# Altium schematic sheet MicroController.SchDoc
size 431 x 279 mm; SheetNumber: 2; SheetTotal: 10
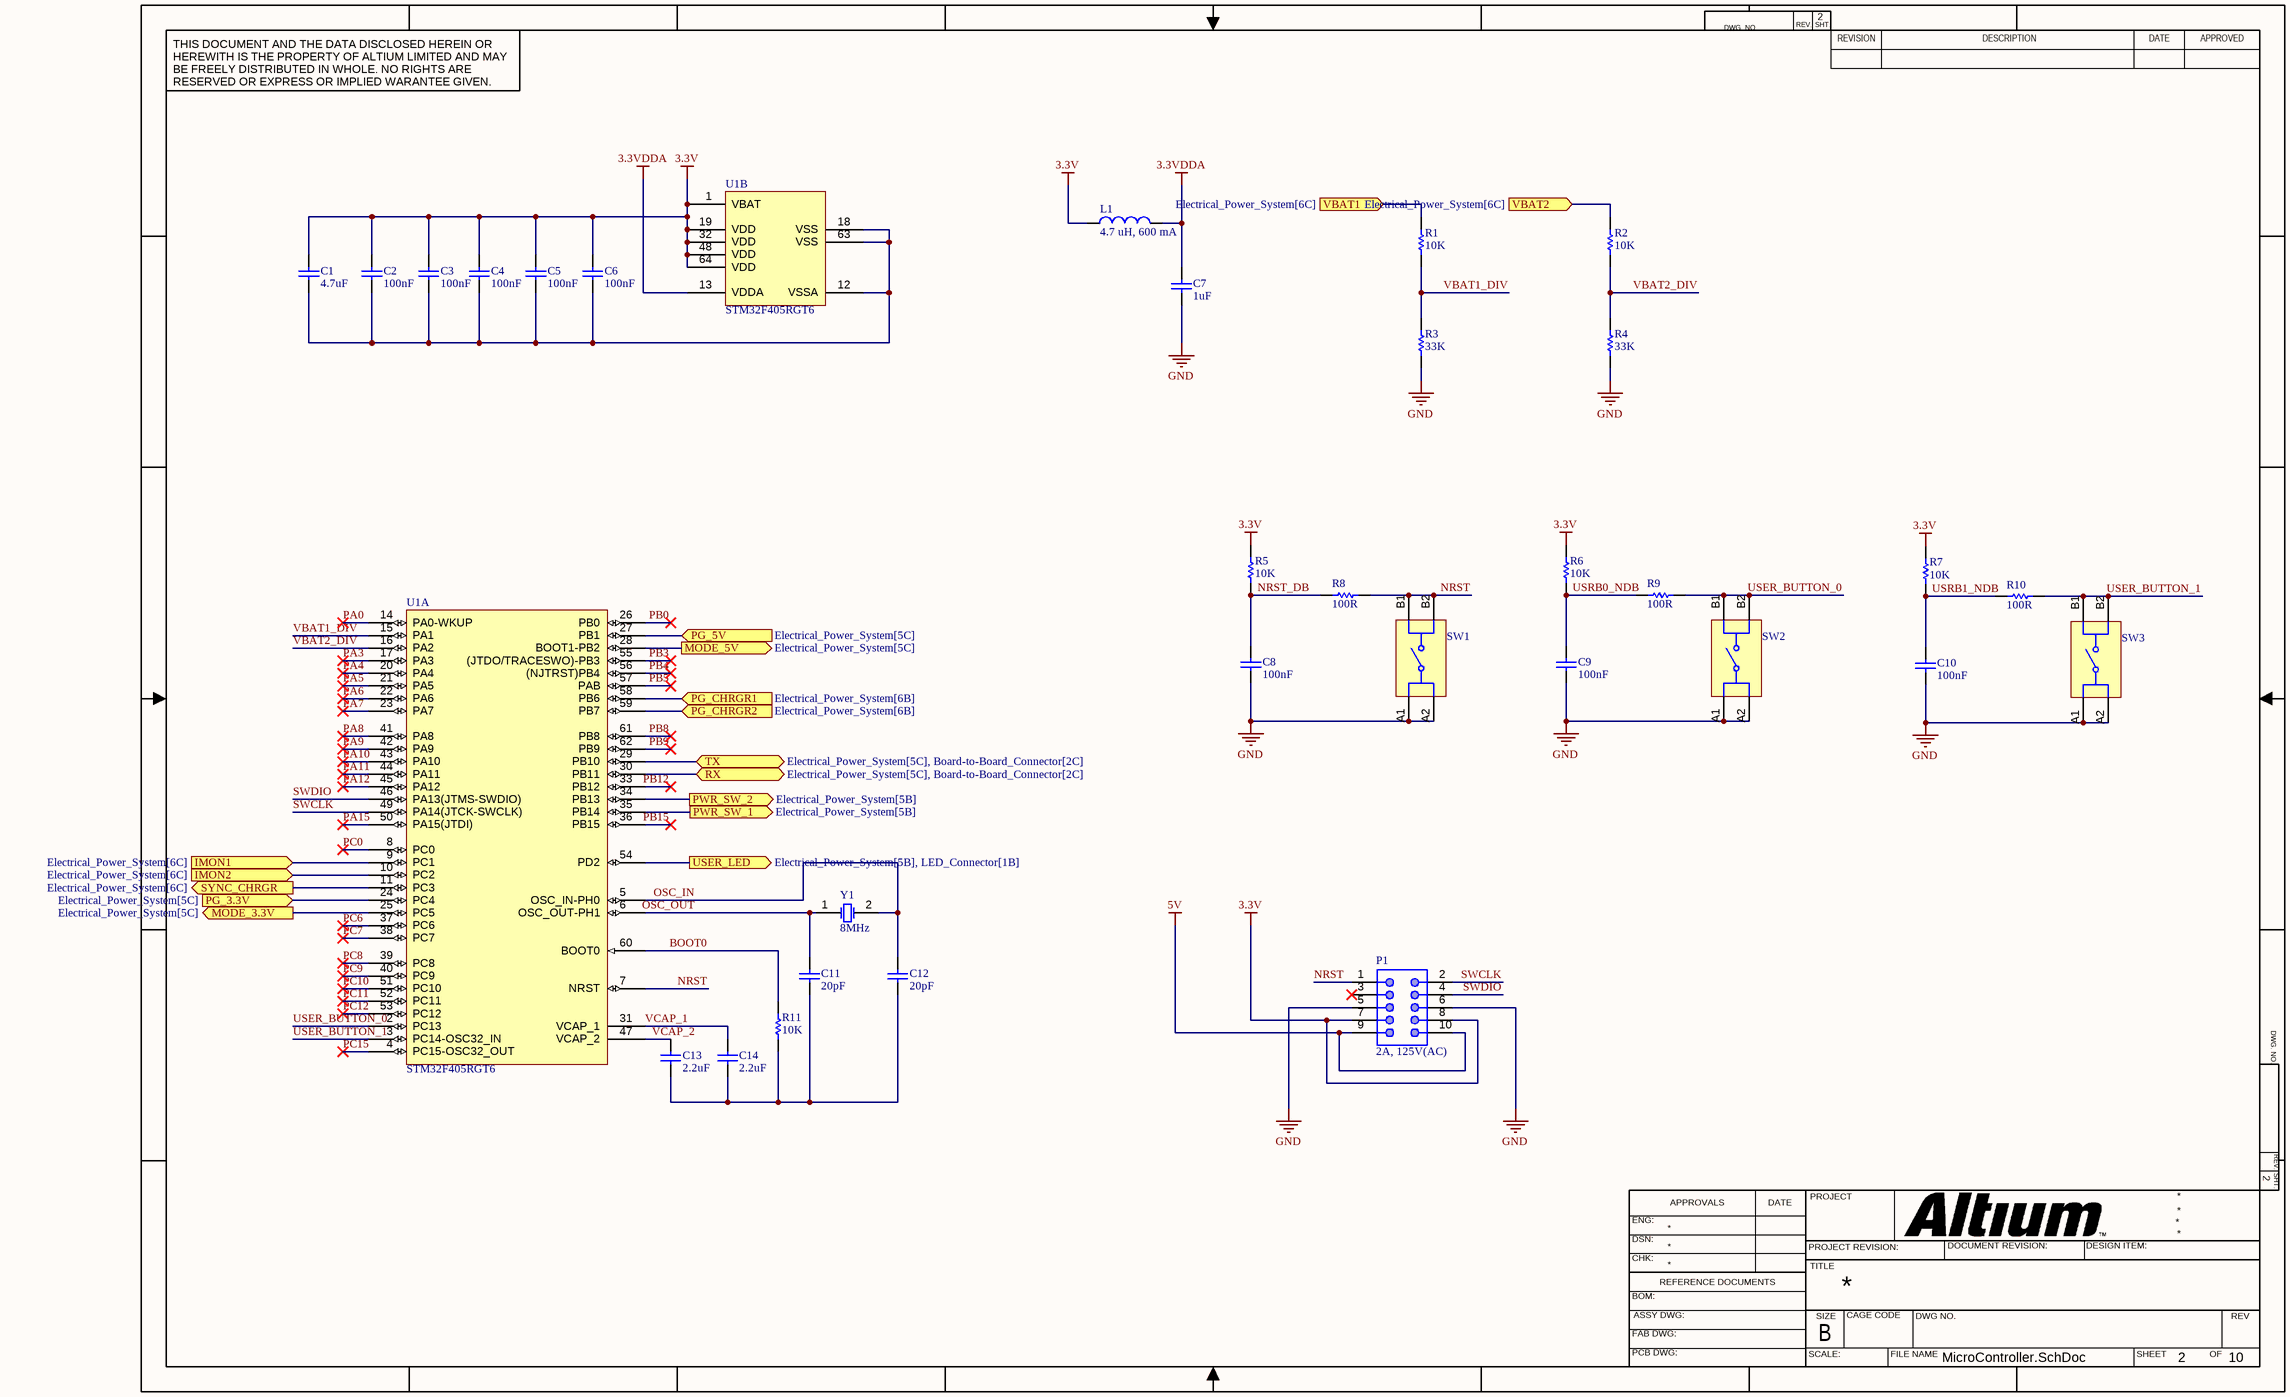
[diagram p0: MicroController.SchDoc]

## Parts
C1  value 4.7uF  [CAP-SM-0603]  (hidden comment: Cap Non-Pol SMD)
C2  value 100nF  [CAP-SM-0603]  (hidden comment: Cap Non-Pol SMD)
C3  value 100nF  [CAP-SM-0603]  (hidden comment: Cap Non-Pol SMD)
C4  value 100nF  [CAP-SM-0603]  (hidden comment: Cap Non-Pol SMD)
C5  value 100nF  [CAP-SM-0603]  (hidden comment: Cap Non-Pol SMD)
C6  value 100nF  [CAP-SM-0603]  (hidden comment: Cap Non-Pol SMD)
C7  value 1uF  [CAP-SM-0603]  (hidden comment: Cap Non-Pol SMD)
C8  value 100nF  [CAP-SM-0805]  (hidden comment: Cap Non-Pol SMD)
C9  value 100nF  [CAP-SM-0805]  (hidden comment: Cap Non-Pol SMD)
C10  value 100nF  [CAP-SM-0805]  (hidden comment: Cap Non-Pol SMD)
C11  value 20pF  [CAP-SM-0603]  (hidden comment: Cap Non-Pol SMD)
C12  value 20pF  [CAP-SM-0603]  (hidden comment: Cap Non-Pol SMD)
C13  value 2.2uF  [CAP-SM-0603]  (hidden comment: Cap Non-Pol SMD)
C14  value 2.2uF  [CAP-SM-0603]  (hidden comment: Cap Non-Pol SMD)
L1  4.7 uH, 600 mA  [0805]
P1  2A, 125V(AC)  [62401021722]
R1  value 10K  [RES-SM-0805]  (hidden comment: RESISTOR SMD)
R2  value 10K  [RES-SM-0805]  (hidden comment: RESISTOR SMD)
R3  value 33K  [RES-SM-0805]  (hidden comment: RESISTOR SMD)
R4  value 33K  [RES-SM-0805]  (hidden comment: RESISTOR SMD)
R5  value 10K  [RES-SM-0805]  (hidden comment: RESISTOR SMD)
R6  value 10K  [RES-SM-0805]  (hidden comment: RESISTOR SMD)
R7  value 10K  [RES-SM-0805]  (hidden comment: RESISTOR SMD)
R8  value 100R  [RES-SM-0805]  (hidden comment: RESISTOR SMD)
R9  value 100R  [RES-SM-0805]  (hidden comment: RESISTOR SMD)
R10  value 100R  [RES-SM-0805]  (hidden comment: RESISTOR SMD)
R11  value 10K  [RES-SM-0805]  (hidden comment: RESISTOR SMD)
SW1  430152050826  [WS-TASV_L6W6H5_4301x20508x6]  (value not drawn)
SW2  430152050826  [WS-TASV_L6W6H5_4301x20508x6]  (value not drawn)
SW3  430152050826  [WS-TASV_L6W6H5_4301x20508x6]  (value not drawn)
U1  STM32F405RGT6  [STM32F405RGT6]  (parts A,B of 2)
Y1  8MHz  [WE-XTAL_HC49/4HSMX]

## Ports
IMON1 (in, see Electrical_Power_System[6C]), IMON2 (in, see Electrical_Power_System[6C]), MODE_3.3V (out, see Electrical_Power_System[5C]), MODE_5V (out, see Electrical_Power_System[5C]), PG_3.3V (in, see Electrical_Power_System[5C]), PG_5V (in, see Electrical_Power_System[5C]), PG_CHRGR1 (in, see Electrical_Power_System[6B]), PG_CHRGR2 (in, see Electrical_Power_System[6B]), PWR_SW_1 (out, see Electrical_Power_System[5B]), PWR_SW_2 (out, see Electrical_Power_System[5B]), RX (bidir, see Electrical_Power_System[5C], Board-to-Board_Connector[2C]), SYNC_CHRGR (out, see Electrical_Power_System[6C]), TX (bidir, see Electrical_Power_System[5C], Board-to-Board_Connector[2C]), USER_LED (out, see Electrical_Power_System[5B], LED_Connector[1B]), VBAT1 (in, see Electrical_Power_System[6C]), VBAT2 (in, see Electrical_Power_System[6C])

## Nets
3.3V: C1.2 C2.2 C3.2 C4.2 C5.2 C6.2 L1.1 P1.7 P1.8 R5.2 R6.2 R7.2 U1.1(VBAT) U1.19(VDD) U1.32(VDD) U1.48(VDD) U1.64(VDD)
3.3VDDA: C7.2 L1.2 U1.13(VDDA)
5V: P1.9 P1.10
GND: C7.1 C8.1 C9.1 C10.1 P1.5 P1.6 R3.1 R4.1 SW1.A1 SW1.A2 SW2.A1 SW2.A2 SW3.A1 SW3.A2
BOOT0: R11.2 U1.60(BOOT0)
IMON1: U1.9(PC1) ; port IMON1
IMON2: U1.10(PC2) ; port IMON2
MODE_3.3V: U1.25(PC5) ; port MODE_3.3V
MODE_5V: U1.28(BOOT1-PB2) ; port MODE_5V
NRST: P1.1 R8.2 SW1.B1 SW1.B2 U1.7(NRST)
NRST_DB: C8.2 R5.1 R8.1
OSC_IN: C12.2 U1.5(OSC_IN-PH0) Y1.2(OSC2)
OSC_OUT: C11.2 U1.6(OSC_OUT-PH1) Y1.1(OSC1)
PA0: U1.14(PA0-WKUP)
PA3: U1.17(PA3)
PA4: U1.20(PA4)
PA5: U1.21(PA5)
PA6: U1.22(PA6)
PA7: U1.23(PA7)
PA8: U1.41(PA8)
PA9: U1.42(PA9)
PA10: U1.43(PA10)
PA11: U1.44(PA11)
PA12: U1.45(PA12)
PA15: U1.50(PA15(JTDI))
PB0: U1.26(PB0)
PB3: U1.55((JTDO/TRACESWO)-PB3)
PB4: U1.56((NJTRST)PB4)
PB5: U1.57(PAB)
PB8: U1.61(PB8)
PB9: U1.62(PB9)
PB12: U1.33(PB12)
PB15: U1.36(PB15)
PC0: U1.8(PC0)
PC6: U1.37(PC6)
PC7: U1.38(PC7)
PC8: U1.39(PC8)
PC9: U1.40(PC9)
PC10: U1.51(PC10)
PC11: U1.52(PC11)
PC12: U1.53(PC12)
PC15: U1.4(PC15-OSC32_OUT)
PG_3.3V: U1.24(PC4) ; port PG_3.3V
PG_5V: U1.27(PB1) ; port PG_5V
PG_CHRGR1: U1.58(PB6) ; port PG_CHRGR1
PG_CHRGR2: U1.59(PB7) ; port PG_CHRGR2
PWR_SW_1: U1.35(PB14) ; port PWR_SW_1
PWR_SW_2: U1.34(PB13) ; port PWR_SW_2
RX: U1.30(PB11) ; port RX
SWCLK: P1.2 U1.49(PA14(JTCK-SWCLK))
SWDIO: P1.4 U1.46(PA13(JTMS-SWDIO))
SYNC_CHRGR: U1.11(PC3) ; port SYNC_CHRGR
TX: U1.29(PB10) ; port TX
USER_BUTTON_0: R9.2 SW2.B1 SW2.B2 U1.2(PC13)
USER_BUTTON_1: R10.2 SW3.B1 SW3.B2 U1.3(PC14-OSC32_IN)
USER_LED: U1.54(PD2) ; port USER_LED
USRB0_NDB: C9.2 R6.1 R9.1
USRB1_NDB: C10.2 R7.1 R10.1
VBAT1: R1.2 ; port VBAT1
VBAT1_DIV: R1.1 R3.2 U1.15(PA1)
VBAT2: R2.2 ; port VBAT2
VBAT2_DIV: R2.1 R4.2 U1.16(PA2)
VCAP_1: C14.2 U1.31(VCAP_1)
VCAP_2: C13.2 U1.47(VCAP_2)
NetC1_1: C1.1 C2.1 C3.1 C4.1 C5.1 C6.1 U1.12(VSSA) U1.18(VSS) U1.63(VSS)
NetC11_1: C11.1 C12.1 C13.1 C14.1 R11.1

Not connected (* = marked no-connect by the designer): P1 3*

## Notes on the sheet
- DWG. NO.
- REV.
- SHT.
- THIS DOCUMENT AND THE DATA DISCLOSED HEREIN OR HEREWITH IS THE PROPERTY OF ALTIUM LIMITED AND MAY BE FREELY DISTRIBUTED IN WHOLE. NO RIGHTS ARE RESERVED OR EXPRESS OR IMPLIED WARANTEE GIVEN.
- REVISION
- DESCRIPTION
- DATE
- APPROVED
- ENG:
- APPROVALS
- PROJECT
- DSN:
- CHK:
- REFERENCE DOCUMENTS
- PROJECT REVISION:
- TITLE
- DOCUMENT REVISION:
- DESIGN ITEM:
- BOM:
- FAB DWG:
- PCB DWG:
- ASSY DWG:
- SCALE:
- SIZE
- B
- CAGE CODE
- FILE NAME
- DWG NO.
- SHEET
- OF
- REV

## Library data of the parts
C1-C14 = Cap Non-Pol SMD: Capacitor
L1 = 02080547520600: Inductor SMD, size 0805, 4.7 uH, 600 mA; Manufacturer: TDK; Manufacturer Part Number: MLZ2012N4R7LTD25; Inductance: 4.7 uH; Tolerance: 20%; Maximum DC Current: 600 mA; Maximum DC Resistance: 180 mOhms; Saturation Current: 130 mA; Packaging: Tape and Reel; Supplier 1 URL: https://www.mouser.vn/ProductDetail/TDK/MLZ2012N4R7LTD25?qs=u4%252BEJ9urDASpSZamVZFpmA%3D%3D; Supplier 2 URL: https://www.digikey.com/en/products/detail/tdk-corporation/MLZ2012N4R7LTD25/4743199; Supplier 3 URL: N/A; ComponentLink1Description: Datasheet; ComponentLink1URL: https://product.tdk.com/system/files/dam/doc/product/inductor/inductor/smd/catalog/inductor_automotive_decoupling_mlz2012_en.pdf?ref_disty=mouser; Value: 4.7 uH, 600 mA; Mount: SMD/SMT; Operating Temperature Max: + 125 C; Operating Temperature Min: - 55 C; Package / Case: 0805; Supplier 1: Mouser; Supplier 1 Part Number: 810-MLZ2012N4R7LTD25; Supplier 2: Digi-Key; Supplier 2 Part Number: 445-16383-2-ND; Supplier 3: thegioiic; Supplier 3 Part Number: OEM
P1 = 62401021722: WR-WTB THT Male Horizontal Shrouded Header with positive locking, Dual Row, pitch 2mm, 10p; Manufacturer: Wurth Elektronik; Pin Number: 10; Contact Resistance: 20mOhm; Rated Current: 3A; Withstanding Voltage: 1000VAC; Working Voltage: 250VAC; ComponentLink1Description: Datasheet; ComponentLink1URL: https://www.we-online.com/catalog/datasheet/62401021722.pdf; Pitch: 2mm; Packaging: Tube; Part Number: 62401021722; Gender: Male; Type: Horizontal; Supplier 1 URL: https://www.mouser.vn/ProductDetail/Wurth-Elektronik/62401021722?qs=E2PpAYvlWVt1BydIyo7tzQ%3D%3D; Supplier 2 URL: N/A; Supplier 3 URL: N/A; Value: 2A, 125V(AC); LCSC Part #: N/A; Manufacturer Part Number: 62401021722; Mount: THT; Operating Temperature Max: + 85 C; Operating Temperature Min: - 25 C; Package / Case: 10; Supplier 1: Mouser; Supplier 1 Part Number: 710-62401021722; Supplier 2: Digi-Key; Supplier 2 Part Number: N/A; Supplier 3: thegioiic; Supplier 3 Part Number: N/A
R1-R11 = RESISTOR SMD: Resistor
SW1-SW3 = 430152050826: WS-TASV SMT Tact Switch, L6 x W6 x H5mm, 260g, SPST-NO, 12V, 50mA; Manufacturer: Wurth Elektronik; Washable: No; Rated Voltage: 12VDC; Manufacturer Part Number: 430152050826; Category: Tact Switches; Match Code: WS-TASV; Mount: Surface Mount; Operating Temperature Max: 85°C; Operating Temperature Min: -40°C; Packaging: Tape and Reel; Length: 6mm; Width: 6mm; Height: 5mm; Circuit: SPST-NO; Contact Material: Stainless Steel; Operation Force: 260g; Rated Current: 50mA; Terminal Material: Copper Alloy; Terminal Plating: Silver; Supplier 1 URL: https://www.mouser.vn/ProductDetail/Wurth-Elektronik/430152050826?qs=wr8lucFkNMXbUWez0eOAow%3D%3D; Supplier 2 URL: https://www.digikey.com/en/products/detail/w%C3%BCrth-elektronik/430152050826/5208996; Supplier 3 URL: https://www.thegioiic.com/nut-nhan-6x6mm-cao-5mm-4-chan-smd; LCSC Part #: N/A; ComponentLink1Description: Datasheet; ComponentLink1URL: https://www.we-online.com/redexpert/spec/430152050826?ad; Package / Case: 0805; Supplier 1: Mouser; Supplier 1 Part Number: 710-430152050826; Supplier 2: Digi-Key; Supplier 2 Part Number: 732-6993-2-ND; Supplier 3: thegioiic; Supplier 3 Part Number: OEM; Value: 430152050826
Y1 = 071105086016: WE-XTAL Quartz Crystal, SMT, HC49/4HSMX, 8MHz, +/-30ppm; Manufacturer Part Number: 830003151; Manufacturer: Wurth Elektronik; Frequency Stability: +/-50ppm; Load Capacitance: 16pF; Frequency: 8MHz; Frequency Tolerance: +/-30ppm; Supplier 3 URL: https://www.thegioiic.com/thach-anh-8mhz-2-chan-smd-hc49-s; ComponentLink1Description: Datasheet; ComponentLink1URL: https://katalog.we-online.com/pbs/datasheet/830003151.pdf; Supplier 1 URL: https://www.mouser.com/ProductDetail/Wurth-Elektronik/830003151?qs=2WXlatMagcHisY7XHApyYg%3D%3D; Supplier 2 URL: https://www.digikey.com/en/products/detail/w%C3%BCrth-elektronik/830003151/13979296; Value: 8MHz; Mount: SMD/SMT; Operating Temperature Max: + 60 C; Operating Temperature Min: - 10 C; Package / Case: HC49/4HSMX; Packaging: Tape and Reel; Supplier 1: Mouser; Supplier 1 Part Number: 710-830003151; Supplier 2: Digi-Key; Supplier 2 Part Number: 732-830003151TR-ND; Supplier 3: thegioiic; Supplier 3 Part Number: N/A